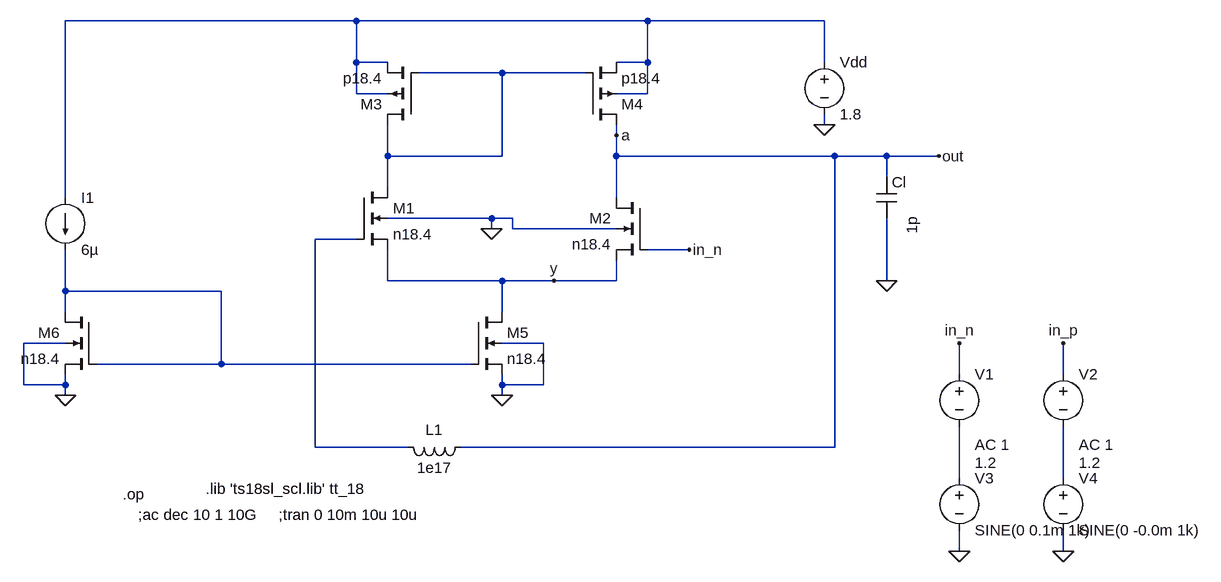
[diagram p0: schematic diff_parmadone.asc]
diff_parmadone.asc, the LTspice schematic file:
Version 4
SHEET 1 1656 932
WIRE 336 96 -112 96
WIRE 784 96 336 96
WIRE 1056 96 784 96
WIRE 336 160 336 96
WIRE 384 160 336 160
WIRE 784 160 784 96
WIRE 784 160 736 160
WIRE 1056 160 1056 96
WIRE 560 176 432 176
WIRE 688 176 560 176
WIRE 336 208 336 160
WIRE 384 208 336 208
WIRE 784 208 784 160
WIRE 784 208 736 208
WIRE 1056 256 1056 240
WIRE 736 272 736 256
WIRE 384 304 384 256
WIRE 560 304 560 176
WIRE 560 304 384 304
WIRE 736 304 736 272
WIRE 1072 304 736 304
WIRE 1152 304 1072 304
WIRE 1232 304 1152 304
WIRE 1152 336 1152 304
WIRE 384 352 384 304
WIRE -112 368 -112 96
WIRE 736 368 736 304
WIRE 544 400 384 400
WIRE 576 400 544 400
WIRE 544 416 544 400
WIRE 576 416 576 400
WIRE 736 416 576 416
WIRE 336 432 272 432
WIRE 848 448 784 448
WIRE 384 496 384 448
WIRE 560 496 384 496
WIRE 640 496 560 496
WIRE 736 496 736 464
WIRE 736 496 640 496
WIRE 1152 496 1152 400
WIRE -112 512 -112 448
WIRE 128 512 -112 512
WIRE -112 544 -112 512
WIRE 560 544 560 496
WIRE -112 592 -176 592
WIRE 624 592 560 592
WIRE 128 624 128 512
WIRE 128 624 -64 624
WIRE 512 624 128 624
WIRE 1264 640 1264 592
WIRE 1424 640 1424 592
WIRE -176 656 -176 592
WIRE -112 656 -112 640
WIRE -112 656 -176 656
WIRE 560 656 560 640
WIRE 624 656 624 592
WIRE 624 656 560 656
WIRE -112 672 -112 656
WIRE 560 672 560 656
WIRE 272 752 272 432
WIRE 416 752 272 752
WIRE 1072 752 1072 304
WIRE 1072 752 496 752
WIRE 1264 800 1264 720
WIRE 1424 800 1424 720
WIRE 1264 912 1264 880
WIRE 1424 912 1424 880
FLAG 1056 256 0
FLAG 560 672 0
FLAG -112 672 0
FLAG 544 416 0
FLAG 1232 304 out
FLAG 848 448 in_n
FLAG 1424 592 in_p
FLAG 1264 592 in_n
FLAG 1264 912 0
FLAG 1424 912 0
FLAG 640 496 y
FLAG 736 272 a
FLAG 1152 496 0
DATAFLAG 1152 400 ""
SYMBOL nmos4 336 352 R0
SYMATTR InstName M1
SYMATTR Value n18.4
SYMATTR Value2 l=1u w=3u
SYMBOL voltage 1056 144 R0
WINDOW 123 0 0 Left 0
WINDOW 39 0 0 Left 0
SYMATTR InstName Vdd
SYMATTR Value 1.8
SYMBOL pmos4 432 256 R180
SYMATTR InstName M3
SYMATTR Value p18.4
SYMATTR Value2 l=1u w=25u
SYMBOL nmos4 784 368 M0
SYMATTR InstName M2
SYMATTR Value n18.4
SYMATTR Value2 l=1u w=3u
SYMBOL pmos4 688 256 M180
SYMATTR InstName M4
SYMATTR Value p18.4
SYMATTR Value2 l=1u w=25u
SYMBOL nmos4 512 544 R0
SYMATTR InstName M5
SYMATTR Value n18.4
SYMATTR Value2 l=1u w=17u
SYMBOL nmos4 -64 544 M0
SYMATTR InstName M6
SYMATTR Value n18.4
SYMATTR Value2 l=1u w=17u
SYMBOL current -112 368 R0
WINDOW 123 0 0 Left 0
WINDOW 39 0 0 Left 0
SYMATTR InstName I1
SYMATTR Value 6µ
SYMBOL cap 1136 336 R0
WINDOW 3 55 88 VLeft 2
SYMATTR Value 1p
SYMATTR InstName Cl
SYMBOL voltage 1264 624 R0
WINDOW 3 24 152 Left 2
WINDOW 123 24 124 Left 2
WINDOW 39 0 0 Left 0
SYMATTR Value 1.2
SYMATTR Value2 AC 1
SYMATTR InstName V1
SYMBOL voltage 1424 624 R0
WINDOW 3 24 152 Left 2
WINDOW 123 24 124 Left 2
WINDOW 39 0 0 Left 0
SYMATTR Value 1.2
SYMATTR Value2 AC 1
SYMATTR InstName V2
SYMBOL voltage 1264 784 R0
WINDOW 123 0 0 Left 0
WINDOW 39 0 0 Left 0
SYMATTR InstName V3
SYMATTR Value SINE(0 0.1m 1k)
SYMBOL voltage 1424 784 R0
WINDOW 123 0 0 Left 0
WINDOW 39 0 0 Left 0
SYMATTR InstName V4
SYMATTR Value SINE(0 -0.0m 1k)
SYMBOL ind 512 736 R90
WINDOW 0 5 56 VBottom 2
WINDOW 3 32 56 VTop 2
SYMATTR InstName L1
SYMATTR Value 1e17
TEXT 104 816 Left 2 !.lib 'ts18sl_scl.lib' tt_18
TEXT -24 824 Left 2 !.op
TEXT 0 856 Left 2 !;ac dec 10 1 10G
TEXT 216 856 Left 2 !;tran 0 10m 10u 10u

The netlist it stands for:
* diff_parmadone.asc
M1 N002 N003 y 0 n18.4 l=1u w=3u
Vdd N001 0 1.8
M3 N002 N002 N001 N001 p18.4 l=1u w=25u
M2 a in_n y 0 n18.4 l=1u w=3u
M4 a N002 N001 N001 p18.4 l=1u w=25u
M5 y N004 0 0 n18.4 l=1u w=17u
M6 N004 N004 0 0 n18.4 l=1u w=17u
I1 N001 N004 6µ
Cl a 0 1p
V1 in_n N005 1.2 AC 1
V2 in_p N006 1.2 AC 1
V3 N005 0 SINE(0 0.1m 1k)
V4 N006 0 SINE(0 -0.0m 1k)
L1 a N003 1e17
.model NMOS NMOS
.model PMOS PMOS
.lib standard.mos
.lib 'ts18sl_scl.lib' tt_18
.op
;ac dec 10 1 10G
;tran 0 10m 10u 10u
.backanno
.end